# EAGLE design Board_4_Buttons_WS-TASV-3 (EAGLE 9.6.2)
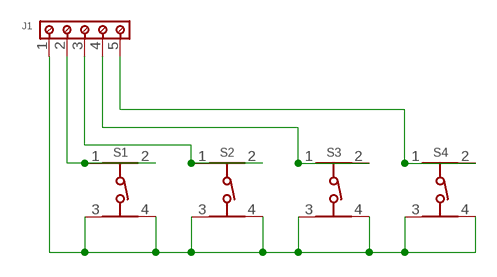
[diagram p0: schematic, sheet 1]

## Parts
J1  691709710305  [691709710305]
S1  430162073826  430466043726  [4304X60437X6]
S2  430162073826  430466043726  [4304X60437X6]
S3  430162073826  430466043726  [4304X60437X6]
S4  430162073826  430466043726  [4304X60437X6]

## Nets
N$1: J1.1 S1.3 S1.4 S2.3 S2.4 S3.3 S3.4 S4.3 S4.4
N$5: J1.2 S1.1 S1.2
N$6: J1.3 S2.1 S2.2
N$7: J1.4 S3.1 S3.2
N$8: J1.5 S4.1 S4.2

## Library data of the parts
J1 = Wurth_Connectors_WR-TBL Rising Cage Clamp:691709710305: WR-TBL Series 7097 - Rising Cage Clamp 5.0mm pitch - Horizontal cable entry - SMT Kind Properties Pitch 5 mm General Information Operating Temperature -40 up to +130 °C Compliance RoHS Electrical Properties IR cULus 6 A Working Voltage [cULus] 300 V (AC) Withstanding Voltage [cULus] 1600 V (AC) Contact Resistance [cULus] 20 mΩ Mechanical Properties Wire Strip Length 7 up to 8 (mm) Screw M3 Material Properties Insulator Material PA46 Insulator Flammability Rating UL94 V-0 Pin Material Brass Pin Plating Tin over Nickel Cage Material Brass Cage Plating Nickel Terminal Screw Material Steel Terminal Screw Plating Zinc Screw M3 Certification cULus Approval E315414 Packaging Properties Packaging Tape and Reel with Cap Wire Properties Wire Strip Length 7 up to 8 (mm) Solid Wire Section (AWG) 30 to 14 (AWG) Solid Wire Section (Metric) 0.2 to 1.5 (mm²) Stranded Wire Section (AWG) 30 to 14 (AWG) Stranded Wire Section (Metric) 0.2 to 1.5 (mm²) <https://www.we-online.com/components/media/o58289v209%20Family_WR-TBL_Serie_7097_6917097103xx.jpg> Details see: www.we-online.com/components/products/TBL_5_00_SMT_7097_HORIZONTAL_ENTRY_SMT_RISING_CAGE_CLAMP_69170971030X <www.we-online.com/catalog/TBL_5_00_SMT_7097_HORIZONTAL_ENTRY_SMT_RISING_CAGE_CLAMP_69170971030X/?utm_source=eagle_model&utm_medium=description_link&utm_campaign=eisos_eagle> Updated by Ella Wu 2023-08-23 2023(C) Wurth Elektronik; DATASHEET-URL: https://www.we-online.com/redexpert/spec/691709710305?ae; IR-UL: 6A; MOUNT: THT; PART-NUMBER: 691709710305; PINS: 5; PITCH: 5mm; TYPE: Horizontal; WIRE: 33 to 14 (AWG) 0.2 to 1.5 (mm²); WORKING-VOLTAGE-UL: 300V (AC)
S1-S4 = Wurth_Switch_WS-TATV:430466043726: WS-TATV THT Washable Tact Switch 12x12 mm Material Properties Cover Material : Stainless Steel Properties Actuator Material:LCP Actuator Flammability Rating:UL94 V-0 Actuator Color:Black; Salmon; White Frame Material:PPA Frame Flammability Rating:UL94 HB Frame Color:Black Contact Material:Stainless Steel Contact Plating:Silver Terminal Material:Copper Alloy Terminal Plating:Silver VR:12 V (DC) Contact Resistance Initial:100 mΩ Contact Resistance After Life Test:2 Ω RISO:100 MΩ Withstanding Voltage:250 V (AC) Washable:Yes Qty.:50 Mechanical Properties Electrical Life:200000 Times; 300000 Times; 500000 Times Stroke :0.3 mm General Information Operating Temperature:-40 up to +85 °C Washable:Yes <https://www.we-online.com/catalog/media/o61120v209%20Family_WS_TSW_THT_4304x60xx7x6_pf2.jpg> Details see: https://www.we-online.com/catalog/en/TATV_12X12_THT_WASHABLE_4304x60xx7x6/ Updated by yingchun,Shan;2020-02-21 2020(C) Würth Elektronik; DATASHEET-URL: https://www.we-online.com/catalog/datasheet/430466043726.pdf; H: 4.3mm; OPERATION-FORCE: 260g; PART-NUMBER: 430466043726; QTY: 50

## Board
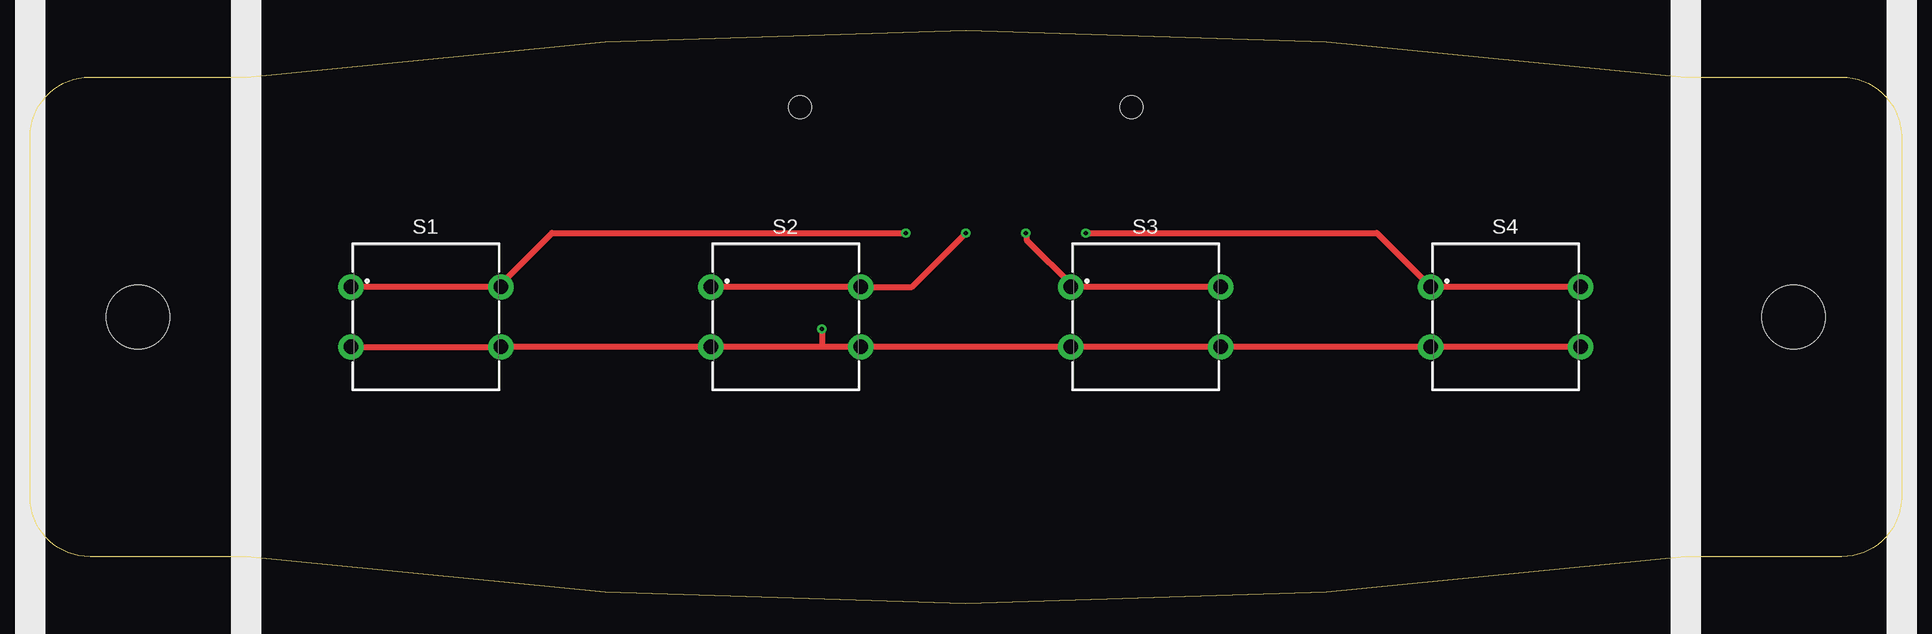
[diagram p1: board, top side]
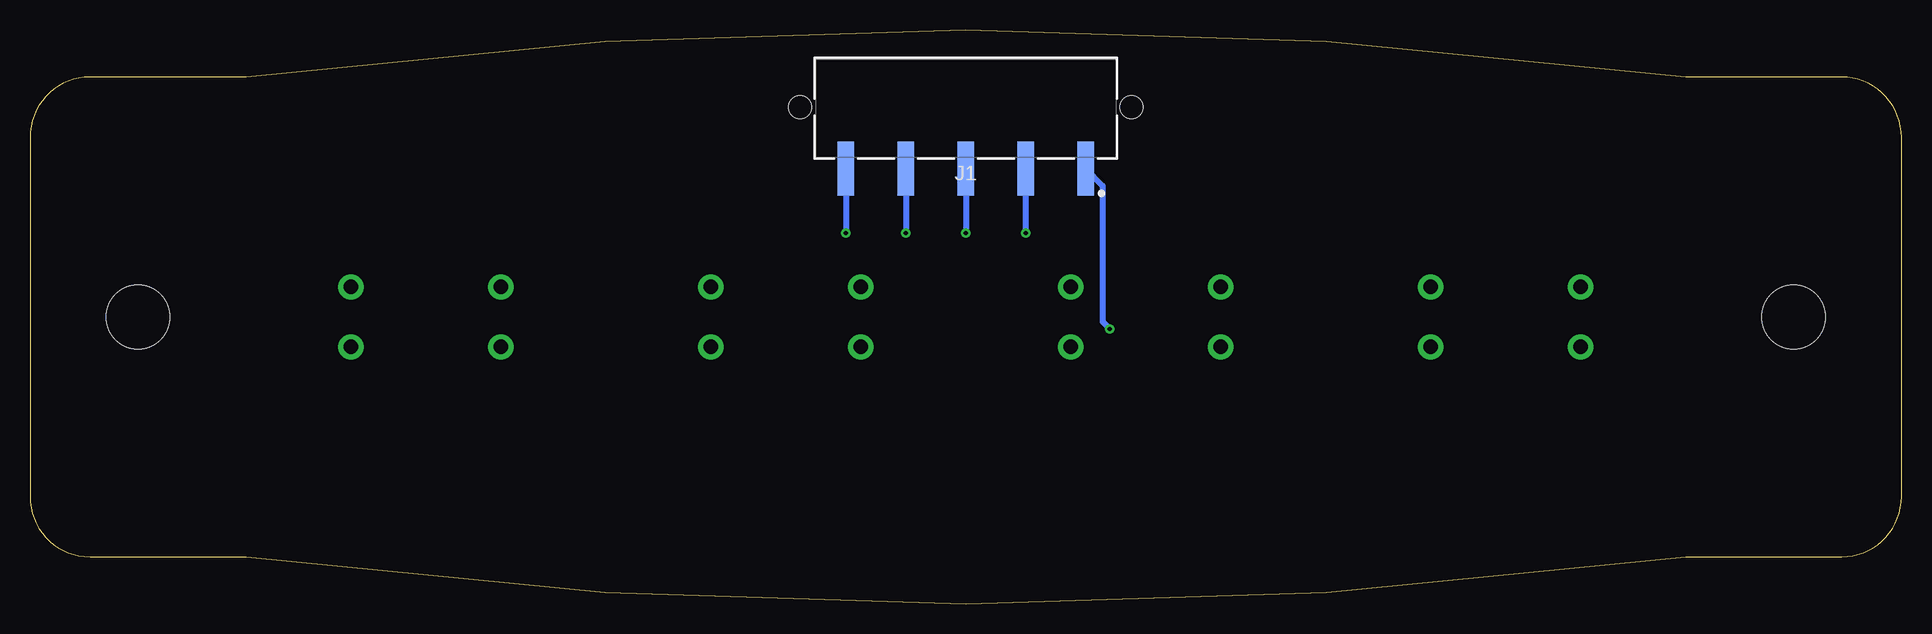
[diagram p2: board, bottom side, seen from below]

Size 156 x 47.87 mm. Coordinates in mm from the lower left corner, seen from the top.
Outline: 18,3.93 5,3.93 arc-90 0,8.93 0,38.93 arc-90 5,43.93 18,43.93 arc-15 138,43.93 151,43.93 arc-90 156,38.93 156,8.93 arc-90 151,3.93 138,3.93 arc-15 18,3.93
Copper layers (1*16): Top 0.035mm / dielectric 1.5mm / Bottom 0.035mm
Design rules "default *": minimum track width 6mil, minimum drill 0.35mm, track to track 6mil, track to pad 6mil, pad to pad 6mil, via to via 6mil, smd to smd 6mil, copper to edge 40mil, drill to drill 6mil, minimum pad ring 0.45mm, minimum via ring 8mil, stop-mask expansion 4mil, vias tented up to drill 4mm, thermal gap 10mil
Holes 5.3 mm at 9,23.93 147,23.93

### Footprints (pad centres in the part's own frame; a part is rotated, then mirrored left to right if it is on the bottom)
691709710305 = smd 1.4 x 4.5: 1 -10,5.15; 2 -5,5.15; 3 0,5.15; 4 5,5.15; 5 10,5.15 | hole 1.9: -13.8,0; 13.8,0
4304X60437X6 = drill 1.2: 1 -6.25,2.5; 2 6.25,2.5; 3 -6.25,-2.5; 4 6.25,-2.5

### Placement (x,y rotation side)
J1  78,41.43 180 bottom
S1  33,23.93 0 top
S2  63,23.93 0 top
S3  93,23.93 0 top
S4  123,23.93 0 top

### Tracks (layer width: path | path; a pad name or v marks a point on that pad's centre or on a via)
N$1  (via drill 0.35)
  Top 0.508: S1.3 S1.4 S2.3 66,21.43 | 66,21.43 S2.4 S3.3 S3.4 S4.3 S4.4 | v66,22.93 66,21.43
  Bottom 0.508: J1.1 66.6,34.89 66.6,23.54 v66,22.93
N$5  (via drill 0.35)
  Top 0.508: S1.2 39,26.43 | 39,26.43 S1.1 | 39,26.43 43.5,30.93 v73,30.93
  Bottom 0.508: v73,30.93 J1.2
N$6  (via drill 0.35)
  Top 0.508: S2.1 S2.2 73.5,26.43 v78,30.93
  Bottom 0.508: J1.3 v78,30.93
N$7  (via drill 0.35)
  Top 0.508: S3.2 87,26.43 | 87,26.43 S3.1 | 87,26.43 83.08,30.35 83.08,30.85 v83,30.93
  Bottom 0.508: J1.4 v83,30.93
N$8  (via drill 0.35)
  Top 0.508: S4.2 S4.1 112.25,30.93 v88,30.93
  Bottom 0.508: J1.5 v88,30.93